# EAGLE design Xbee_Shield_v11 (EAGLE 6.2)
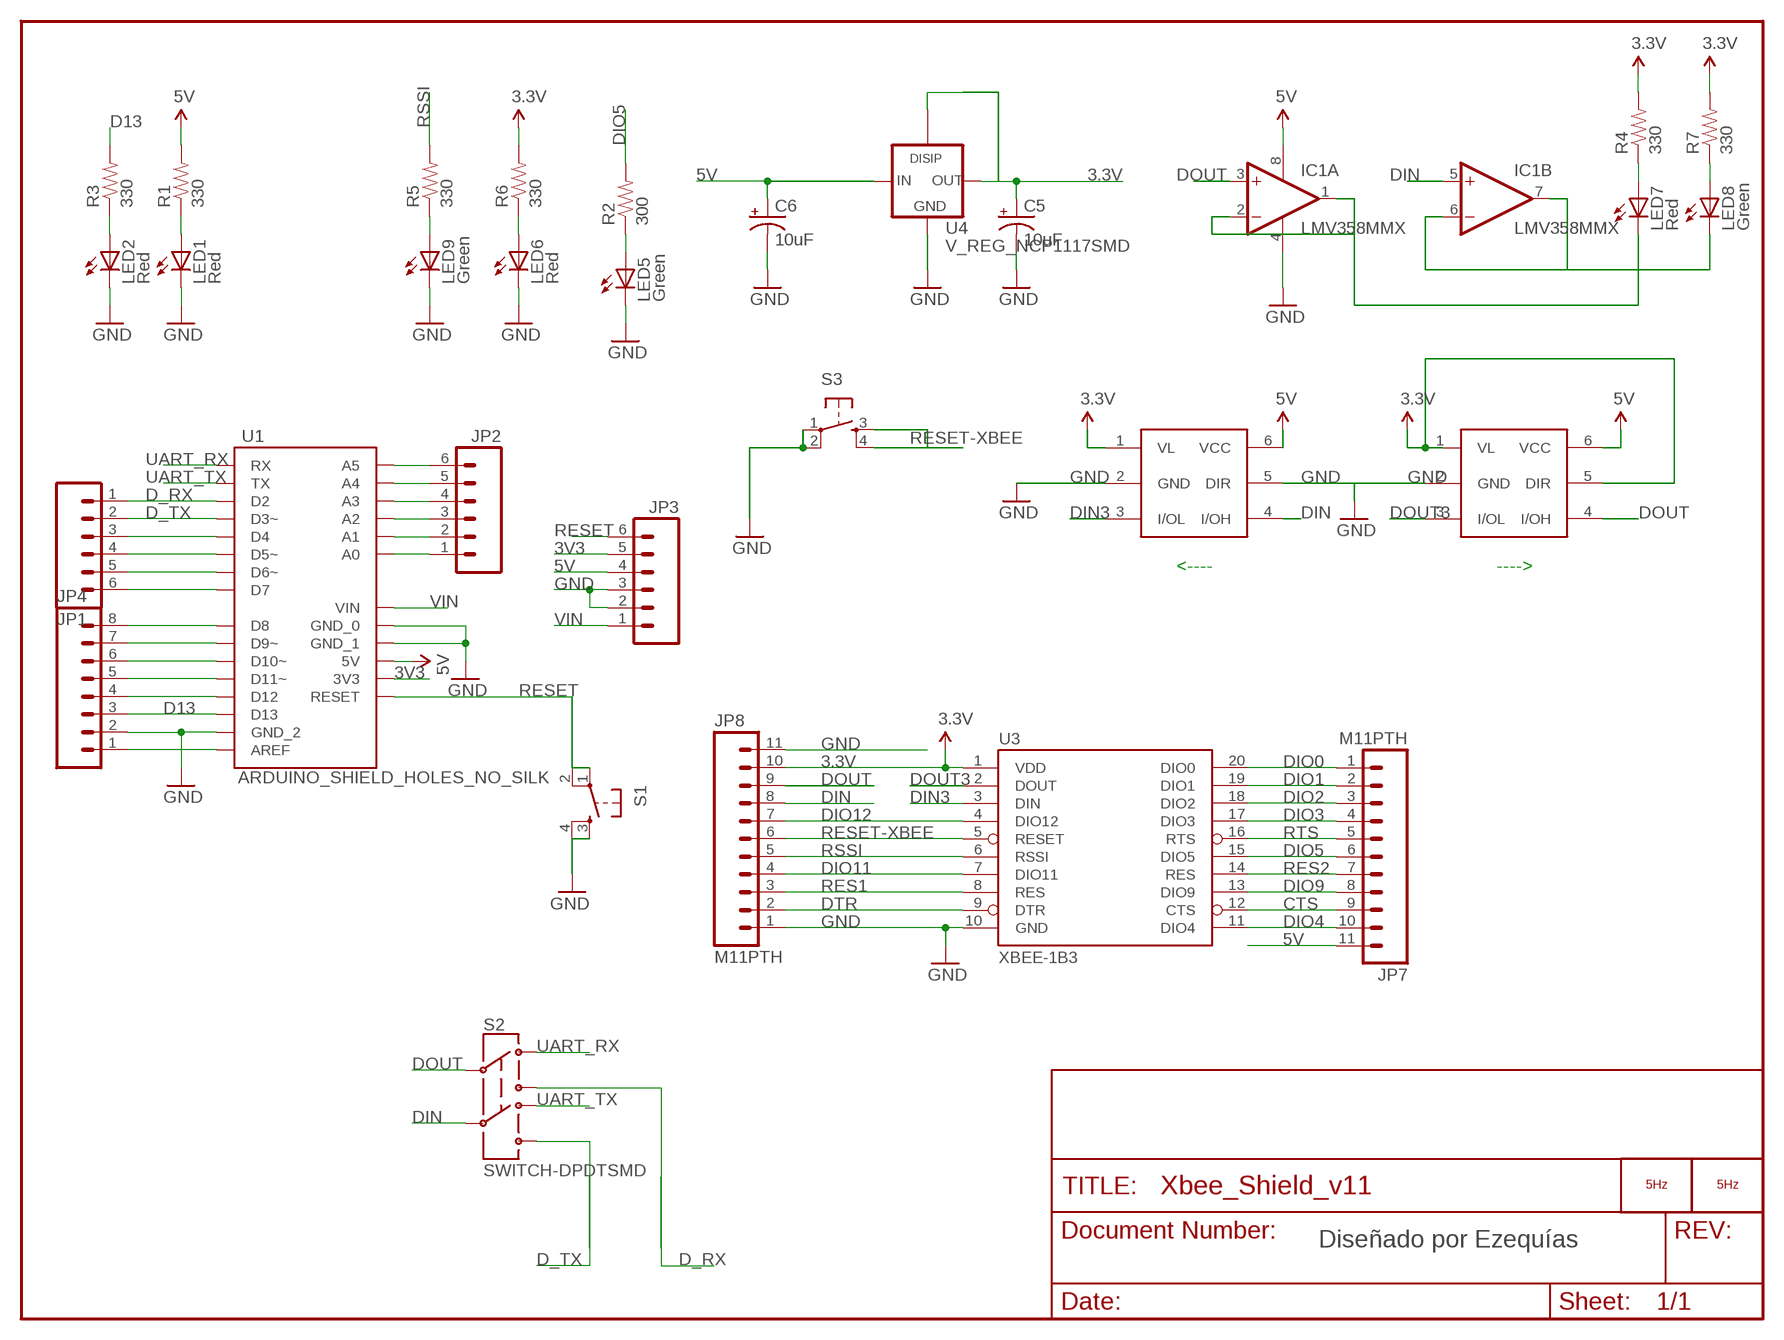
[diagram p0: schematic, sheet 1]

## Parts
C5  10uF  CAP_POL1206  [EIA3216]
C6  10uF  CAP_POL1206  [EIA3216]
IC1  LMV358MMX  [MSOP08]
JP1  M06SIP  [1X06]
JP2  M06SIP  [1X06]
JP3  M06SIP  [1X06]
JP4  M081X08  [1X08]
JP7  M11PTH  [1X11]
JP8  M11PTH  [1X11]
LED1  Red  LED0603  [LED-0603]
LED2  Red  LED0603  [LED-0603]
LED5  Green  LED0603  [LED-0603]
LED6  Red  LED0603  [LED-0603]
LED7  Red  LED0603  [LED-0603]
LED8  Green  LED0603  [LED-0603]
LED9  Green  LED0603  [LED-0603]
LOGO1  LOGO_5HZ_H_20MM  [5HZ_LOGO_H_20MM]
LOGO2  LOGO_5HZ_WEB_COOPER_10MM  [5HZ_WEB_COOPER_10MM]
R1  330  RESISTOR0603-RES  [0603-RES]
R2  300  RESISTOR0603-RES  [0603-RES]
R3  330  RESISTOR0603-RES  [0603-RES]
R4  330  RESISTOR0603-RES  [0603-RES]
R5  330  RESISTOR0603-RES  [0603-RES]
R6  330  RESISTOR0603-RES  [0603-RES]
R7  330  RESISTOR0603-RES  [0603-RES]
S1  TAC_SWITCHSMD  [TACTILE_SWITCH_SMD]
S2  SWITCH-DPDTSMD  [AYZ0202]
S3  TAC_SWITCHSMD  [TACTILE_SWITCH_SMD]
U1  ARDUINO_SHIELD_HOLES_NO_SILK  [UNO_SHIELD_HOLES_NO_SILK]
U3  XBEE-1B3  [XBEE-SMD]
U4  V_REG_NCP1117SMD  [SOT223]
U$7  MAX337  [SOT-363]
U$8  MAX337  [SOT-363]

## Nets
3.3V: C5.A(+) JP8.10 R4.2 R6.2 R7.2 U3.1(VDD) U4.2(OUT) U4.4 U$7.1(VL) U$8.1(VL) U$8.5(DIR)
3V3: JP3.5 U1.3.3V(3V3)
5V: C6.A(+) IC1.8(P:V+) JP3.4 JP7.11 R1.2 U1.5V U4.3(IN) U$7.6(VCC) U$8.6(VCC)
CTS: JP7.9 U3.12(CTS)
D13: JP4.3 R3.2 U1.D13
D_RX: JP1.1 S2.3 U1.D2
D_TX: JP1.2 S2.6 U1.D3(D3~)
DIN: IC1.5(B:+IN) JP8.8 S2.5 U$7.4(I/OH)
DIN3: U3.3(DIN) U$7.3(I/OL)
DIO0: JP7.1 U3.20(DIO0)
DIO1: JP7.2 U3.19(DIO1)
DIO2: JP7.3 U3.18(DIO2)
DIO3: JP7.4 U3.17(DIO3)
DIO4: JP7.10 U3.11(DIO4)
DIO5: JP7.6 R2.2 U3.15(DIO5)
DIO9: JP7.8 U3.13(DIO9)
DIO11: JP8.4 U3.7(DIO11)
DIO12: JP8.7 U3.4(DIO12)
DOUT: IC1.3(A:+IN) JP8.9 S2.2 U$8.4(I/OH)
DOUT3: U3.2(DOUT) U$8.3(I/OL)
DTR: JP8.2 U3.9(DTR)
GND: C5.C(-) C6.C(-) IC1.4(P:V-) JP3.2 JP3.3 JP4.2 JP8.1 JP8.11 LED1.C LED2.C LED5.C LED6.C LED9.C S1.3 S1.4 S3.1 S3.2 U1.GND_0 U1.GND_1 U1.GND_2 U3.10(GND) U4.1(GND) U$7.2(GND) U$7.5(DIR) U$8.2(GND)
N$1: JP2.6 U1.A5
N$2: JP2.5 U1.A4
N$3: JP2.4 U1.A3
N$4: JP2.3 U1.A2
N$5: JP2.2 U1.A1
N$6: JP4.8 U1.D8
N$7: JP4.7 U1.D9(D9~)
N$8: JP4.6 U1.D10(D10~)
N$9: JP4.5 U1.D11(D11~)
N$10: JP4.4 U1.D12
N$11: IC1.1(A:OUT) IC1.2(A:-IN) LED7.C
N$12: JP1.6 U1.D7
N$13: JP1.5 U1.D6(D6~)
N$14: JP1.4 U1.D5(D5~)
N$15: JP1.3 U1.D4
N$16: JP2.1 U1.A0
N$17: LED1.A R1.1
N$18: LED6.A R6.1
N$19: LED7.A R4.1
N$20: LED8.A R7.1
N$21: LED9.A R5.1
N$22: JP4.1 U1.AREF
N$24: IC1.6(B:-IN) IC1.7(B:OUT) LED8.C
N$25: LED2.A R3.1
N$139: LED5.A R2.1
RES1: JP8.3 U3.8(RES)
RES2: JP7.7 U3.14(RES)
RESET: JP3.6 S1.1 S1.2 U1.RES(RESET)
RESET-XBEE: JP8.6 S3.3 S3.4 U3.5(RESET)
RSSI: JP8.5 R5.2 U3.6(RSSI)
RTS: JP7.5 U3.16(RTS)
UART_RX: S2.1 U1.RX
UART_TX: S2.4 U1.TX
VIN: JP3.1 U1.VIN

## Notes on the sheet
- <---- | ---->
- Diseñado por Ezequías

## Library data of the parts
C5 C6 = SparkFun:CAP_POL: Capacitor Polarized These are standard SMD and PTH capacitors. Normally 10uF, 47uF, and 100uF in electrolytic and tantalum varieties. Always verify the external diameter of the through hole cap, it varies with capacity, voltage, and manufacturer. The EIA devices should be standard.
IC1 = linear:LMV358?*: Dual General Purpose, Low Voltage, Rail-to-Rail Output Operational Amplifiers Source: http://www.national.com/mpf/LM/LMV321.html http://www.national.com/dt/lmv_qual.pdf
JP1-JP3 = SparkFun:M06: Header 6 Standard 6-pin 0.1" header. Use with straight break away headers (SKU : PRT-00116), right angle break away headers (PRT-00553), swiss pins (PRT-00743), machine pins (PRT-00117), and female headers (PRT-00115). Molex polarized connector foot print use with SKU : PRT-08094 with associated crimp pins and housings. NOTES ON THE VARIANTS LOCK and LOCK_LONGPADS... This footprint was designed to help hold the alignment of a through-hole component (i.e. 6-pin header) while soldering it into place. You may notice that each hole has been shifted either up or down by 0.005 of an inch from it's more standard position (which is a perfectly straight line). This slight alteration caused the pins (the squares in the middle) to touch the edges of the holes. Because they are alternating, it causes a "brace" to hold the component in place. 0.005 has proven to be the perfect amount of "off-center" position when using our standard breakaway headers. Although looks a little odd when you look at the bare footprint, once you have a header in there, the alteration is very hard to notice. Also, if you push a header all the way into place, it is covered up entirely on the bottom side. This idea of altering the position of holes to aid alignment will be further integrated into the Sparkfun Library for other footprints. It can help hold any component with 3 or more connection pins.
JP4 = SparkFun:M08: Header 8 Standard 8-pin 0.1" header. Use with straight break away headers (SKU : PRT-00116), right angle break away headers (PRT-00553), swiss pins (PRT-00743), machine pins (PRT-00117), and female headers (PRT-00115).
JP7 JP8 = SparkFun:M11: Header 11 Standard 11-pin 0.1" header. Use with straight break away headers (SKU : PRT-00116), right angle break away headers (PRT-00553), swiss pins (PRT-00743), machine pins (PRT-00117), and female headers (PRT-00115).
LED1 LED2 LED5-LED9 = SparkFun:LED: LEDs Standard schematic elements and footprints for 5mm, 3mm, 1206, and 0603 sized LEDs. 5mm - Spark Fun Electronics SKU : COM-00529 (and others)
LOGO1 LOGO2 = 5hz-electronica:LOGO_5HZ: Logotipo 5Hz "según Pedro"
R1-R7 = SparkFun:RESISTOR: Resistor Basic schematic elements and footprints for 0603, 1206, and PTH resistors.
S1 S3 = SparkFun:TAC_SWITCH: Momentary Switch Button commonly used for reset or general input. Spark Fun Electronics SKU : COM-00097
S2 = SparkFun:SWITCH-DPDT: DPDT Version of the COM-00597
U1 = 5hz-electronica:ARDUINO_SHIELD
U3 = SparkFun:XBEE-1
U4 = 5hz-electronica:V_REG_NCP1117: Voltage Regulator The NCP1117 series are low dropout positive voltage regulators that are capable of providing an output current that is in excess of 1.0 A with a maximum dropout voltage of 1.2 V at 800 mA over temperature. This series contains eight fixed output voltages of 1.5 V, 1.8 V, 2.0 V, 2.5 V, 2.85 V, 3.3 V, 5.0 V, and 12 V that have no minimum load requirement to maintain regulation. Also included is an adjustable output version that can be programmed from 1.25 V to 18.8 V with two external resistors. On chip trimming adjusts the reference/output voltage to within ±1.0% accuracy. Internal protection features consist of output current limiting, safe operating area compensation, and thermal shutdown. The NCP1117 series can operate with up to 20 V input. Devices are available in SOT-223 and DPAK packages.
U$7 U$8 = 74LVCH1T45:MAX337

## Net classes
1 vcc: width 0.254 mm

## Board
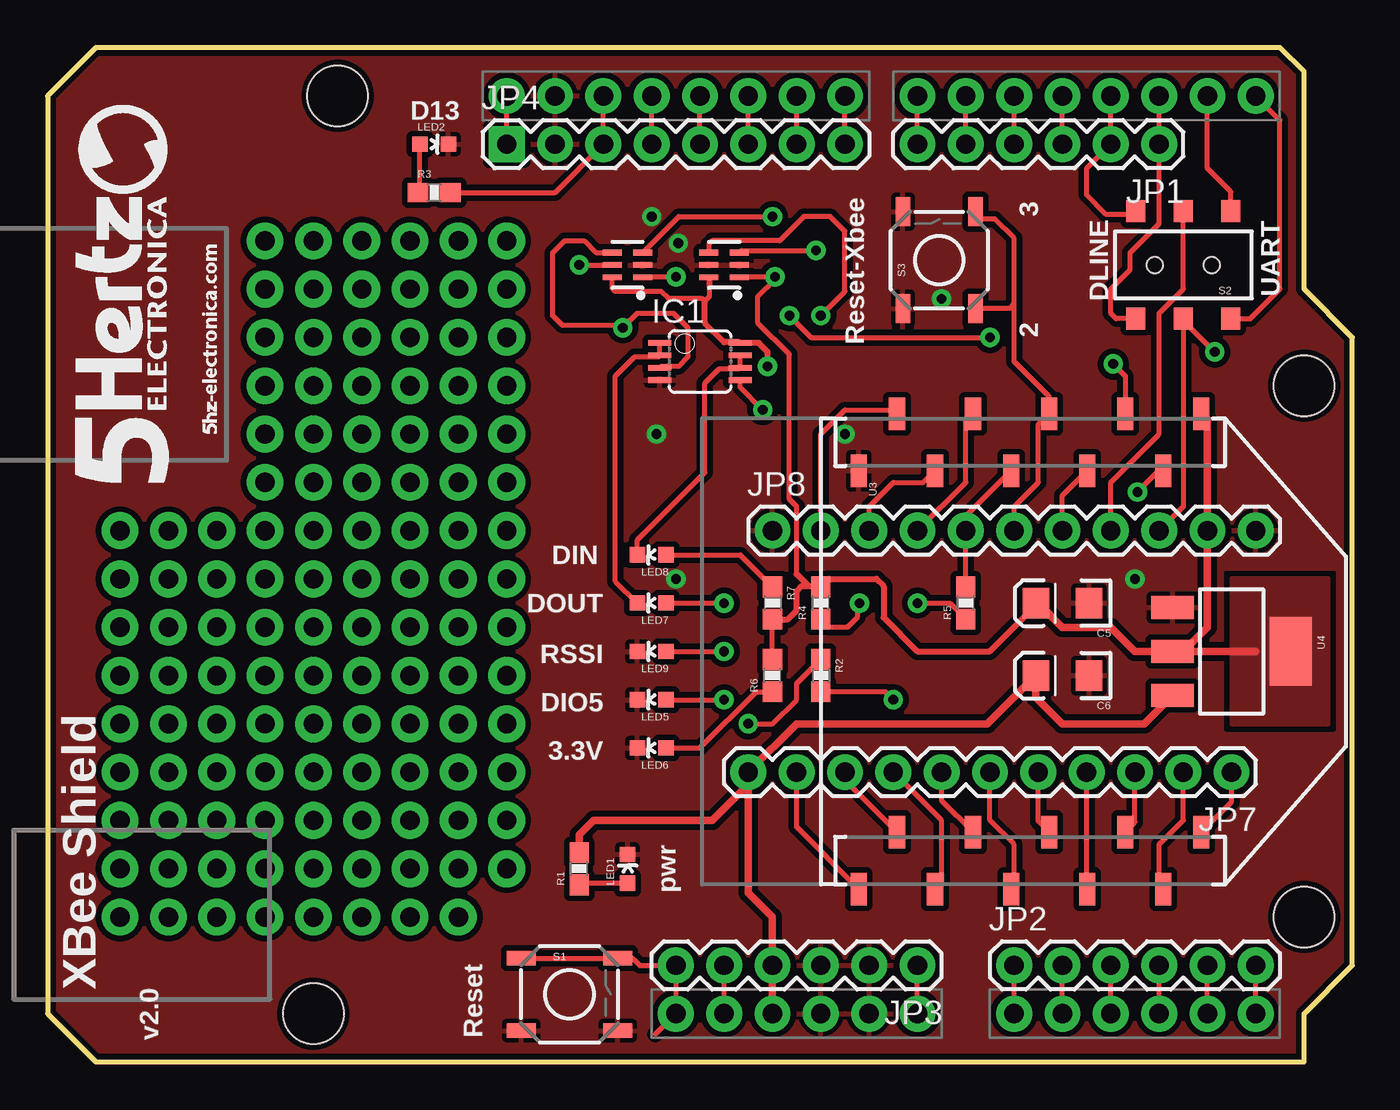
[diagram p1: board, top side]
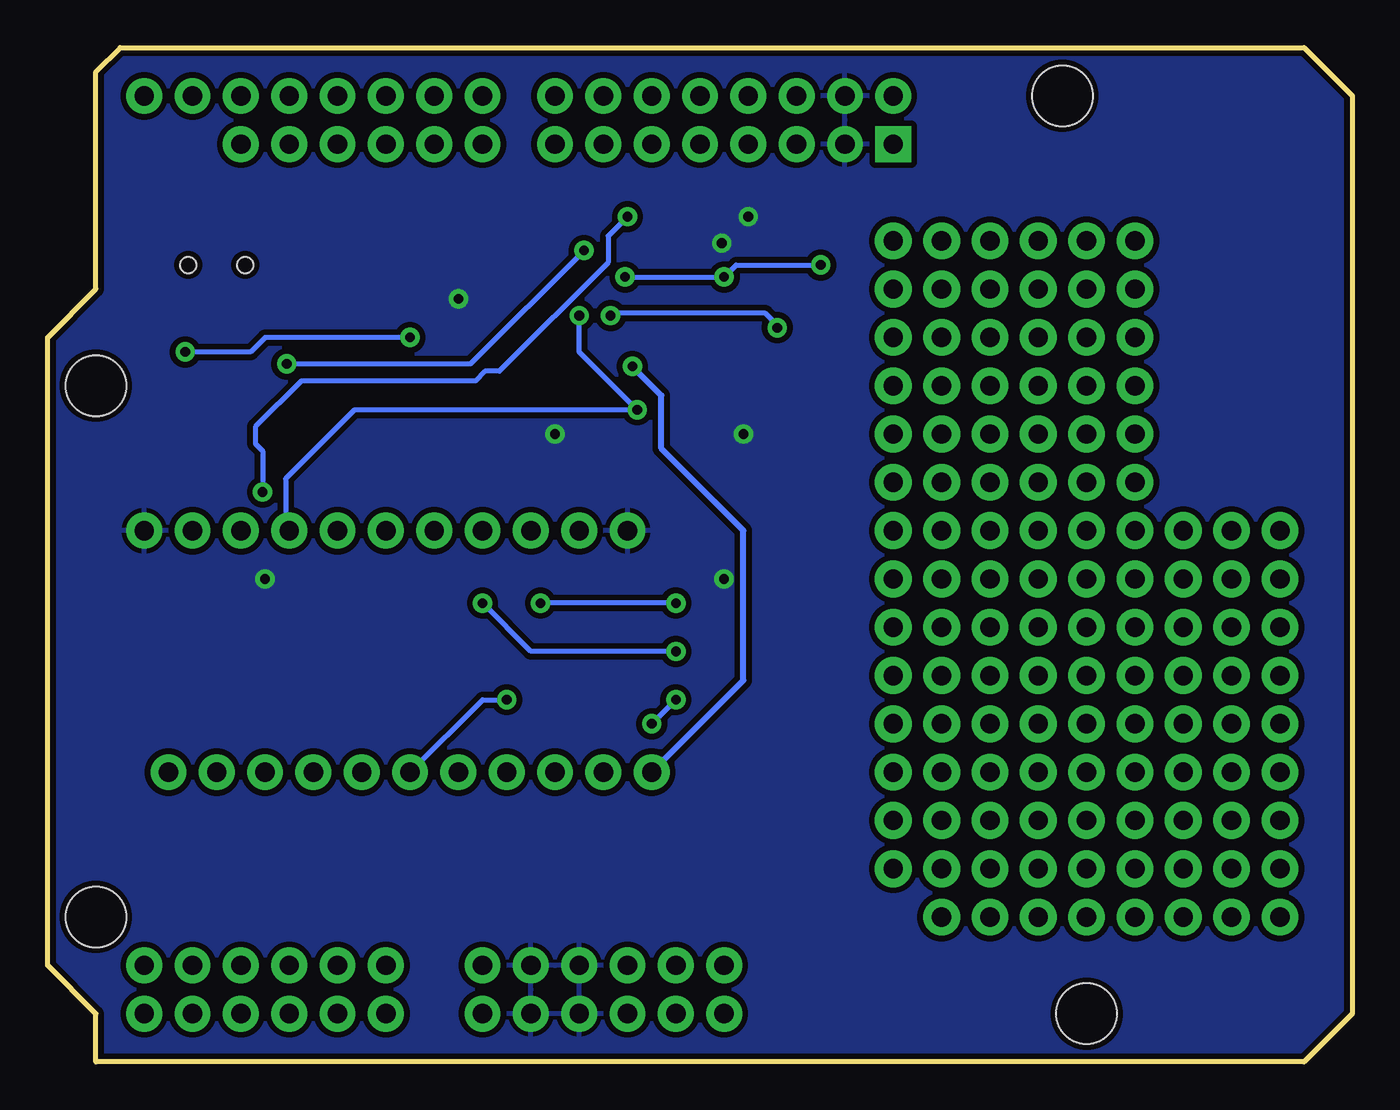
[diagram p2: board, bottom side, seen from below]

Size 68.58 x 53.34 mm. Coordinates in mm from the lower left corner, seen from the top.
Outline: 0,2.54 2.54,0 66.04,0 66.04,2.54 68.58,5.08 68.58,38.1 66.04,40.64 66.04,52.07 64.77,53.34 2.54,53.34 0,50.8 0,2.54
Copper layers (1*16): Top 0.035mm / dielectric 1.5mm / Bottom 0.035mm
Design rules: minimum track width 8mil, minimum drill 20mil, track to track 8mil, track to pad 8mil, pad to pad 8mil, via to via 8mil, smd to smd 8mil, copper to edge 10mil, drill to drill 8mil, minimum pad ring 12mil, minimum via ring 10mil, stop-mask expansion 4mil, vias tented up to drill 25mil, thermal gap 10mil

### Footprints (pad centres in the part's own frame; a part is rotated, then mirrored left to right if it is on the bottom)
EIA3216 = smd 1.4 x 1.6: A 1.4,0; C -1.4,0
MSOP08 = smd 0.3 x 1.2: 1 -0.976,-2.113; 2 -0.326,-2.113; 3 0.324,-2.113; 4 0.974,-2.113; 5 0.974,2.112; 6 0.324,2.112; 7 -0.326,2.112; 8 -0.976,2.112
1X06 = drill 1.016 pad 1.88: 1 0,0; 2 2.54,0; 3 5.08,0; 4 7.62,0; 5 10.16,0; 6 12.7,0
1X08 = drill 1.016 pad 1.88 square: 1 0,0 | drill 1.016 pad 1.88: 2 2.54,0; 3 5.08,0; 4 7.62,0; 5 10.16,0; 6 12.7,0; 7 15.24,0; 8 17.78,0
1X11 = drill 1.016 pad 1.88: 1 0,0; 2 2.54,0; 3 5.08,0; 4 7.62,0; 5 10.16,0; 6 12.7,0; 7 15.24,0; 8 17.78,0; 9 20.32,0; 10 22.86,0; 11 25.4,0
LED-0603 = smd 0.8 x 0.8: A 0,-0.75; C 0,0.75
0603-RES = smd 1.1 x 1: 1 -0.85,0; 2 0.85,0
TACTILE_SWITCH_SMD = smd 1.524 x 0.762: 1 -2.54,1.905; 2 2.54,1.905; 3 -2.54,-1.905; 4 2.54,-1.905
AYZ0202 = smd 1 x 1.15: 1 -2.5,2.825; 2 0,2.825; 3 2.5,2.825; 4 -2.5,-2.825; 5 0,-2.825; 6 2.5,-2.825 | hole 0.85: 1.5,0; -1.5,0
UNO_SHIELD_HOLES_NO_SILK = drill 1.016 pad 1.88: 3.3V 35.56,2.54; 5V 38.1,2.54; A0 50.8,2.54; A1 53.34,2.54; A2 55.88,2.54; A3 58.42,2.54; A4 60.96,2.54; A5 63.5,2.54; AREF 24.13,50.8; D2 58.42,50.8; D3 55.88,50.8; D4 53.34,50.8; D5 50.8,50.8; D6 48.26,50.8; D7 45.72,50.8; D8 41.91,50.8; D9 39.37,50.8; D10 36.83,50.8; D11 34.29,50.8; D12 31.75,50.8; D13 29.21,50.8; GND_0 43.18,2.54; GND_1 40.64,2.54; GND_2 26.67,50.8; RES 33.02,2.54; RX 63.5,50.8; TX 60.96,50.8; VIN 45.72,2.54 | hole 3.175: 15.24,50.8; 66.04,35.56; 66.04,7.62; 13.97,2.54
XBEE-SMD = smd 1.7 x 0.85: 1 -12.5,20; 2 -9.5,18; 3 -12.5,16; 4 -9.5,14; 5 -12.5,12; 6 -9.5,10; 7 -12.5,8; 8 -9.5,6; 9 -12.5,4; 10 -9.5,2; 11 12.5,2; 12 9.5,4; 13 12.5,6; 14 9.5,8; 15 12.5,10; 16 9.5,12; 17 12.5,14; 18 9.5,16; 19 12.5,18; 20 9.5,20
SOT223 = smd 1.219 x 2.235: 1 -2.311,-3.099; 2 0,-3.099; 3 2.311,-3.099 | smd 3.6 x 2.2: 4 0,3.099
SOT-363 = smd 0.3 x 0.99: 1 -0.65,-0.8; 2 0,-0.8; 3 0.65,-0.8; 4 0.65,0.81; 5 0,0.81; 6 -0.65,0.81

### Placement (x,y rotation side)
C5  53.34,24.13 180 top
C6  53.34,20.32 180 top
IC1  34.29,36.83 270 top
JP1  58.42,48.26 180 top
JP2  50.8,5.08 0 top
JP3  45.72,5.08 180 top
JP4  24.13,48.26 0 top
JP7  62.23,15.24 180 top
JP8  38.1,27.94 0 top
LED1  30.48,10.16 0 top
LED2  20.32,48.26 270 top
LED5  31.75,19.05 90 top
LED6  31.75,16.51 90 top
LED7  31.75,24.13 90 top
LED8  31.75,26.67 90 top
LED9  31.75,21.59 90 top
LOGO1  6.35,30.48 90 top
LOGO2  8.89,33.02 90 top
R1  27.94,10.16 90 top
R2  40.64,20.32 270 top
R3  20.32,45.72 0 top
R4  40.64,24.13 90 top
R5  48.26,24.13 90 top
R6  38.1,20.32 90 top
R7  38.1,24.13 270 top
S1  27.43,3.56 0 top
S2  59.69,41.91 180 top
S3  46.86,42.16 90 top
U1  0,0 0 top
U3  40.64,21.59 270 top
U4  62.23,21.59 270 top
U$7  35.56,41.91 90 top
U$8  30.48,41.91 90 top

### Tracks (layer width: path | path; a pad name or v marks a point on that pad's centre or on a via)
3.3V  (via drill 0.51)
  Top 0.254: 60.96,33.77 U3.1 | R6.2 R7.2 | 52.07,24.13 C5.A 51.94,24 | U$8.1 33.01,41.26 v33.02,41.27 | U$7.1 36.38,41.27 v38.23,41.27 38.23,41.15 37.34,40.26 37.34,38.86 38.99,37.21 38.99,29.59 39.37,29.21 39.37,25.65 | U4.2 59.69,21.59 | v27.94,41.91 U$8.5
  Top 0.305: 51.94,24 49.53,21.59 45.72,21.59 43.94,23.37 43.94,25.02 43.56,25.4 41.06,25.4 R4.2 | R7.2 38.9,23.28 39.37,23.75 39.37,24.77 39.62,25.02 40.01,25.02 | 40.01,25.02 40.6,25.02 | 40.01,25.02 39.37,25.65
  Top 0.406: 60.96,33.77 JP8.10 60.96,22.86 59.69,21.59 63.5,21.59 | U4.2 57.15,21.59 55.88,22.86 53.34,22.86 52.07,24.13 | 40.6,25.02 R4.2
  Bottom 0.254: v38.23,41.27 v33.02,41.27 32.38,41.91 v27.94,41.91
  pour Top (isolate 0.305, no thermals): 62.23,25.4 62.23,17.78 67.31,17.78 67.31,25.4
3V3
  Top 0.254: U1.3.3V JP3.5
5V  (via drill 0.51)
  Top 0.254: U$8.6 29.67,40.69 29.84,40.51 32.26,40.51 32.64,40.13 34.42,40.13 34.54,40.01 34.8,40.26 34.8,40.77
  Top 0.305: 34.8,40.77 34.8,41.21 U$7.6 | 34.54,40.01 34.54,38.86 35.56,37.85 36.36,37.85 IC1.8 37.38,37.81 37.85,37.34 v37.85,36.58
  Top 0.406: 36.83,14.61 36.83,8.89 38.1,7.62 JP3.4 U1.5V | 36.83,14.61 JP7.11 39.37,17.78 49.4,17.78 C6.A 51.94,19.18 53.34,17.78 57.63,17.78 U4.3 | R1.2 27.94,11.94 28.7,12.7 34.92,12.7 36.83,14.61
  Bottom 0.305: v37.85,36.58 36.32,35.05 36.32,32.26 32,27.94 32,20.07 JP7.11
CTS
  Top 0.254: JP7.9 41.91,14.82 U3.12
D13
  Top 0.254: U1.D13 JP4.3 26.67,45.72 R3.2
D_RX
  Top 0.254: U1.D2 JP1.1 58.42,44.07 56.9,42.55 56.9,41.66 55.88,40.64 55.88,39.37 56.16,39.09 S2.3
D_TX
  Top 0.254: U1.D3 JP1.2 54.61,46.99 54.61,45.59 55.63,44.58 57.03,44.58 S2.6
DIN  (via drill 0.51)
  Top 0.254: JP8.8 55.88,30.48 58.42,33.02 58.42,39.37 59.69,40.64 S2.5 | IC1.5 36.4,35.48 v37.59,34.29 | U$7.4 34.75,43.01 34.92,43.18 38.48,43.18 39.75,44.45 41.15,44.45 41.91,43.69 41.91,40.51 v40.64,39.24
  Bottom 0.254: JP8.8 56.07,28.13 56.07,30.67 52.45,34.29 v37.59,34.29 40.64,37.34 v40.64,39.24
DIN3  (via drill 0.51)
  Top 0.254: U3.3 56.64,36.07 v56.01,36.7 | v40.39,42.67 36.47,42.67 U$7.3
  Bottom 0.254: v56.01,36.7 46.35,36.7 v40.39,42.67
DIO0
  Top 0.254: JP7.1 62.23,13.68 U3.20
DIO1
  Top 0.254: JP7.2 59.69,12.7 58.42,11.43 58.42,9.31 U3.19
DIO2
  Top 0.254: JP7.3 57.15,12.6 U3.18
DIO3
  Top 0.254: JP7.4 54.61,9.12 U3.17
DIO4
  Top 0.254: JP7.10 39.37,12.36 U3.11
DIO5  (via drill 0.51)
  Top 0.254: JP7.6 49.53,12.7 50.8,11.43 50.8,9.25 U3.15 | R2.2 44.03,19.47 v44.45,19.05
  Bottom 0.254: v44.45,19.05 45.72,19.05 JP7.6
DIO9
  Top 0.254: JP7.8 46.99,12.7 46.99,9.44 U3.13
DIO11
  Top 0.254: JP8.4 48.26,30.48 48.26,33.71 U3.7
DIO12
  Top 0.254: JP8.7 53.34,29.79 U3.4
DOUT  (via drill 0.51)
  Top 0.254: JP8.9 59.69,29.21 S2.2 59.69,38.99 v61.34,37.34 | IC1.3 32.25,36.58 33.15,36.58 33.66,37.08 33.66,38.61 32.89,39.37 30.99,39.37 v30.23,38.61 30.1,38.73 27.05,38.73 26.54,39.24 26.54,42.55 27.18,43.18 28.19,43.18 28.81,42.56 29.86,42.56 | U$8.4 29.66,42.55 | v49.53,38.1 40.13,38.1 v38.99,39.24
  Top 0.305: 29.86,42.56 U$8.4
  Bottom 0.254: v61.34,37.34 57.91,37.34 57.15,38.1 v49.53,38.1 | v30.23,38.61 30.23,38.73 30.86,39.37 38.86,39.37 v38.99,39.24
DOUT3  (via drill 0.51)
  Top 0.254: U3.2 58.4,31.09 v57.28,29.97 | v38.1,44.45 33.17,44.45 U$8.3
  Bottom 0.254: v38.1,44.45 39.12,43.43 39.12,42.04 44.83,36.32 45.59,36.32 46.1,35.81 55.24,35.81 57.66,33.4 57.66,32.51 57.28,32.13 v57.28,29.97
DTR
  Top 0.254: JP8.2 40.64,33.02 41.91,34.29 44.44,34.29 U3.9
GND  (via drill 0.51)
  other vias: 46.99,40.13 41.91,33.02 57.15,25.4 33.02,25.4 32,33.02 33.15,43.05 31.75,44.45
  pour Top (isolate 0.305, rank 2): 0,50.8 2.54,53.34 64.77,53.34 66.04,52.07 66.04,40.64 68.58,38.1 68.58,5.08 66.04,2.54 66.04,0 2.54,0 0,2.54
  pour Bottom (isolate 0.305, rank 2): 0,50.8 2.54,53.34 64.77,53.34 66.04,52.07 66.04,40.64 68.58,38.1 68.58,5.08 66.04,2.54 66.04,0 2.54,0 0,2.54
N$1
  Top 0.254: U1.A5 JP2.6
N$2
  Top 0.254: U1.A4 JP2.5
N$3
  Top 0.254: U1.A3 JP2.4
N$4
  Top 0.254: U1.A2 JP2.3
N$5
  Top 0.254: U1.A1 JP2.2
N$6
  Top 0.254: JP4.8 U1.D8
N$7
  Top 0.254: JP4.7 U1.D9
N$8
  Top 0.254: JP4.6 U1.D10
N$9
  Top 0.254: JP4.5 U1.D11
N$10
  Top 0.254: JP4.4 U1.D12
N$11
  Top 0.254: LED7.C 30.99,24.13 29.84,25.27 29.84,36.07 30.86,37.08 32.1,37.08 IC1.2 IC1.1
N$12
  Top 0.254: JP1.6 U1.D7
N$13
  Top 0.254: JP1.5 U1.D6
N$14
  Top 0.254: JP1.4 U1.D5
N$15
  Top 0.254: JP1.3 U1.D4
N$16
  Top 0.254: U1.A0 JP2.1
N$17
  Top 0.254: LED1.A 28.04,9.41 R1.1
N$18
  Top 0.254: R6.1 37.25,19.47 34.29,16.51 LED6.A
N$19  (via drill 0.51)
  Top 0.254: LED7.A v35.56,24.13 | R4.1 41.06,22.86 42.04,22.86 42.55,23.37 42.55,24 v42.67,24.13
  Bottom 0.254: v35.56,24.13 v42.67,24.13
N$20
  Top 0.254: LED8.A 36.41,26.67 R7.1
N$21  (via drill 0.51)
  Top 0.254: LED9.A v35.56,21.59 | v45.72,24.13 47.41,24.13 R5.1
  Bottom 0.254: v45.72,24.13 43.18,21.59 v35.56,21.59
N$22
  Top 0.254: JP4.1 U1.AREF
N$23  (via drill 1.02 pad 1.93)
  other vias: 3.81,7.62
N$24
  Top 0.254: LED8.C 31,27.44 34.54,30.99 34.54,35.69 35.31,36.45 36.34,36.45 IC1.6 IC1.7
N$25
  Top 0.254: LED2.A 19.57,45.82 R3.1
N$28  (via drill 1.02 pad 1.93)
  other vias: 11.43,43.18
N$29  (via drill 1.02 pad 1.93)
  other vias: 13.97,43.18
N$30  (via drill 1.02 pad 1.93)
  other vias: 16.51,43.18
N$31  (via drill 1.02 pad 1.93)
  other vias: 19.05,43.18
N$32  (via drill 1.02 pad 1.93)
  other vias: 21.59,43.18
N$33  (via drill 1.02 pad 1.93)
  other vias: 11.43,40.64
N$34  (via drill 1.02 pad 1.93)
  other vias: 13.97,40.64
N$35  (via drill 1.02 pad 1.93)
  other vias: 16.51,40.64
N$36  (via drill 1.02 pad 1.93)
  other vias: 19.05,40.64
N$37  (via drill 1.02 pad 1.93)
  other vias: 21.59,40.64
N$38  (via drill 1.02 pad 1.93)
  other vias: 11.43,38.1
N$39  (via drill 1.02 pad 1.93)
  other vias: 13.97,38.1
N$40  (via drill 1.02 pad 1.93)
  other vias: 16.51,38.1
N$41  (via drill 1.02 pad 1.93)
  other vias: 19.05,38.1
N$42  (via drill 1.02 pad 1.93)
  other vias: 21.59,38.1
N$43  (via drill 1.02 pad 1.93)
  other vias: 11.43,35.56
N$44  (via drill 1.02 pad 1.93)
  other vias: 13.97,35.56
N$45  (via drill 1.02 pad 1.93)
  other vias: 16.51,35.56
N$46  (via drill 1.02 pad 1.93)
  other vias: 19.05,35.56
N$47  (via drill 1.02 pad 1.93)
  other vias: 21.59,35.56
N$48  (via drill 1.02 pad 1.93)
  other vias: 11.43,33.02
N$49  (via drill 1.02 pad 1.93)
  other vias: 13.97,33.02
N$50  (via drill 1.02 pad 1.93)
  other vias: 16.51,33.02
N$51  (via drill 1.02 pad 1.93)
  other vias: 19.05,33.02
N$52  (via drill 1.02 pad 1.93)
  other vias: 21.59,33.02
N$53  (via drill 1.02 pad 1.93)
  other vias: 11.43,30.48
N$54  (via drill 1.02 pad 1.93)
  other vias: 13.97,30.48
N$55  (via drill 1.02 pad 1.93)
  other vias: 16.51,30.48
N$56  (via drill 1.02 pad 1.93)
  other vias: 19.05,30.48
N$57  (via drill 1.02 pad 1.93)
  other vias: 21.59,30.48
N$58  (via drill 1.02 pad 1.93)
  other vias: 11.43,27.94
N$59  (via drill 1.02 pad 1.93)
  other vias: 13.97,27.94
N$60  (via drill 1.02 pad 1.93)
  other vias: 16.51,27.94
N$61  (via drill 1.02 pad 1.93)
  other vias: 19.05,27.94
N$62  (via drill 1.02 pad 1.93)
  other vias: 21.59,27.94
N$63  (via drill 1.02 pad 1.93)
  other vias: 11.43,25.4
N$64  (via drill 1.02 pad 1.93)
  other vias: 13.97,25.4
N$65  (via drill 1.02 pad 1.93)
  other vias: 16.51,25.4
N$66  (via drill 1.02 pad 1.93)
  other vias: 19.05,25.4
N$67  (via drill 1.02 pad 1.93)
  other vias: 21.59,25.4
N$68  (via drill 1.02 pad 1.93)
  other vias: 11.43,22.86
N$69  (via drill 1.02 pad 1.93)
  other vias: 13.97,22.86
N$70  (via drill 1.02 pad 1.93)
  other vias: 16.51,22.86
N$71  (via drill 1.02 pad 1.93)
  other vias: 19.05,22.86
N$72  (via drill 1.02 pad 1.93)
  other vias: 21.59,22.86
N$73  (via drill 1.02 pad 1.93)
  other vias: 11.43,20.32
N$74  (via drill 1.02 pad 1.93)
  other vias: 13.97,20.32
N$75  (via drill 1.02 pad 1.93)
  other vias: 16.51,20.32
N$76  (via drill 1.02 pad 1.93)
  other vias: 19.05,20.32
N$77  (via drill 1.02 pad 1.93)
  other vias: 21.59,20.32
N$78  (via drill 1.02 pad 1.93)
  other vias: 11.43,17.78
N$79  (via drill 1.02 pad 1.93)
  other vias: 13.97,17.78
N$80  (via drill 1.02 pad 1.93)
  other vias: 16.51,17.78
N$81  (via drill 1.02 pad 1.93)
  other vias: 19.05,17.78
N$82  (via drill 1.02 pad 1.93)
  other vias: 21.59,17.78
N$83  (via drill 1.02 pad 1.93)
  other vias: 11.43,15.24
N$84  (via drill 1.02 pad 1.93)
  other vias: 13.97,15.24
N$85  (via drill 1.02 pad 1.93)
  other vias: 16.51,15.24
N$86  (via drill 1.02 pad 1.93)
  other vias: 19.05,15.24
N$87  (via drill 1.02 pad 1.93)
  other vias: 21.59,15.24
N$88  (via drill 1.02 pad 1.93)
  other vias: 11.43,12.7
N$89  (via drill 1.02 pad 1.93)
  other vias: 13.97,12.7
N$90  (via drill 1.02 pad 1.93)
  other vias: 16.51,12.7
N$91  (via drill 1.02 pad 1.93)
  other vias: 19.05,12.7
N$92  (via drill 1.02 pad 1.93)
  other vias: 21.59,12.7
N$93  (via drill 1.02 pad 1.93)
  other vias: 11.43,10.16
N$94  (via drill 1.02 pad 1.93)
  other vias: 13.97,10.16
N$95  (via drill 1.02 pad 1.93)
  other vias: 16.51,10.16
N$96  (via drill 1.02 pad 1.93)
  other vias: 19.05,10.16
N$97  (via drill 1.02 pad 1.93)
  other vias: 21.59,10.16
N$98  (via drill 1.02 pad 1.93)
  other vias: 11.43,7.62
N$99  (via drill 1.02 pad 1.93)
  other vias: 13.97,7.62
N$100  (via drill 1.02 pad 1.93)
  other vias: 16.51,7.62
N$101  (via drill 1.02 pad 1.93)
  other vias: 19.05,7.62
N$102  (via drill 1.02 pad 1.93)
  other vias: 21.59,7.62
N$103  (via drill 1.02 pad 1.93)
  other vias: 6.35,12.7
N$104  (via drill 1.02 pad 1.93)
  other vias: 8.89,7.62
N$105  (via drill 1.02 pad 1.93)
  other vias: 3.81,27.94
N$106  (via drill 1.02 pad 1.93)
  other vias: 6.35,27.94
N$107  (via drill 1.02 pad 1.93)
  other vias: 8.89,27.94
N$108  (via drill 1.02 pad 1.93)
  other vias: 8.89,12.7
N$109  (via drill 1.02 pad 1.93)
  other vias: 3.81,10.16
N$110  (via drill 1.02 pad 1.93)
  other vias: 3.81,25.4
N$111  (via drill 1.02 pad 1.93)
  other vias: 6.35,25.4
N$112  (via drill 1.02 pad 1.93)
  other vias: 8.89,25.4
N$113  (via drill 1.02 pad 1.93)
  other vias: 8.89,15.24
N$114  (via drill 1.02 pad 1.93)
  other vias: 6.35,10.16
N$115  (via drill 1.02 pad 1.93)
  other vias: 3.81,22.86
N$116  (via drill 1.02 pad 1.93)
  other vias: 6.35,22.86
N$117  (via drill 1.02 pad 1.93)
  other vias: 8.89,22.86
N$118  (via drill 1.02 pad 1.93)
  other vias: 6.35,15.24
N$119  (via drill 1.02 pad 1.93)
  other vias: 8.89,10.16
N$120  (via drill 1.02 pad 1.93)
  other vias: 3.81,20.32
N$121  (via drill 1.02 pad 1.93)
  other vias: 6.35,20.32
N$122  (via drill 1.02 pad 1.93)
  other vias: 8.89,20.32
N$123  (via drill 1.02 pad 1.93)
  other vias: 3.81,15.24
N$124  (via drill 1.02 pad 1.93)
  other vias: 3.81,12.7
N$125  (via drill 1.02 pad 1.93)
  other vias: 3.81,17.78
N$126  (via drill 1.02 pad 1.93)
  other vias: 6.35,17.78
N$127  (via drill 1.02 pad 1.93)
  other vias: 8.89,17.78
N$128  (via drill 1.02 pad 1.93)
  other vias: 6.35,7.62
N$130  (via drill 1.02 pad 1.93)
  other vias: 24.13,43.18
N$131  (via drill 1.02 pad 1.93)
  other vias: 24.13,40.64
N$132  (via drill 1.02 pad 1.93)
  other vias: 24.13,38.1
N$133  (via drill 1.02 pad 1.93)
  other vias: 24.13,35.56
N$134  (via drill 1.02 pad 1.93)
  other vias: 24.13,33.02
N$135  (via drill 1.02 pad 1.93)
  other vias: 24.13,30.48
N$136  (via drill 1.02 pad 1.93)
  other vias: 24.13,27.94
N$137  (via drill 1.02 pad 1.93)
  other vias: 24.13,25.4
N$138  (via drill 1.02 pad 1.93)
  other vias: 24.13,22.86
N$139  (via drill 0.51)
  Top 0.254: LED5.A v35.56,19.05 | v36.83,17.78 38.1,17.78 39.37,19.05 39.37,19.9 R2.1
  Bottom 0.254: v35.56,19.05 v36.83,17.78
N$142  (via drill 1.02 pad 1.93)
  other vias: 24.13,20.32
N$143  (via drill 1.02 pad 1.93)
  other vias: 24.13,17.78
N$144  (via drill 1.02 pad 1.93)
  other vias: 24.13,15.24
N$145  (via drill 1.02 pad 1.93)
  other vias: 24.13,12.7
N$146  (via drill 1.02 pad 1.93)
  other vias: 24.13,10.16
RES1
  Top 0.254: JP8.3 43.18,29.21 44.45,30.48 46.03,30.48 U3.8
RES2
  Top 0.254: JP7.7 46.99,13.74 U3.14
RESET
  Top 0.254: 30.73,5.46 30.48,5.71 29.73,5.71 | 31.94,1.46 U1.RES JP3.6 31.11,5.08 30.8,5.4 30.73,5.46 | S1.1 S1.2 30.73,5.46
RESET-XBEE
  Top 0.254: JP8.6 50.8,29.21 52.07,30.48 52.07,33.52 U3.5 52.64,34.99 50.8,36.83 50.8,39.88 | 50.8,39.88 50.79,39.87 50.55,39.62 S3.3 | 50.8,39.88 50.8,43.31 49.78,44.32 49.02,44.32 49.02,44.45 S3.4
RSSI
  Top 0.254: U3.6 48.26,28.71 JP8.5 R5.2
RTS
  Top 0.254: JP7.5 52.07,12.66 U3.16
UART_RX
  Top 0.254: S2.1 63.22,39.09 64.77,40.64 64.77,49.53 U1.RX
UART_TX
  Top 0.254: S2.4 62.19,45.76 60.96,46.99 U1.TX
VIN
  Top 0.254: U1.VIN JP3.1

### Text on the board
tPlace: D13 | 3 | DLINE | UART | Reset-Xbee | 2 | DIN | DOUT | RSSI | DIO5 | 3.3V | pwr | XBee Shield | v2.0 | Reset